# EAGLE design MCP4725_v14 (EAGLE 6.5.0)
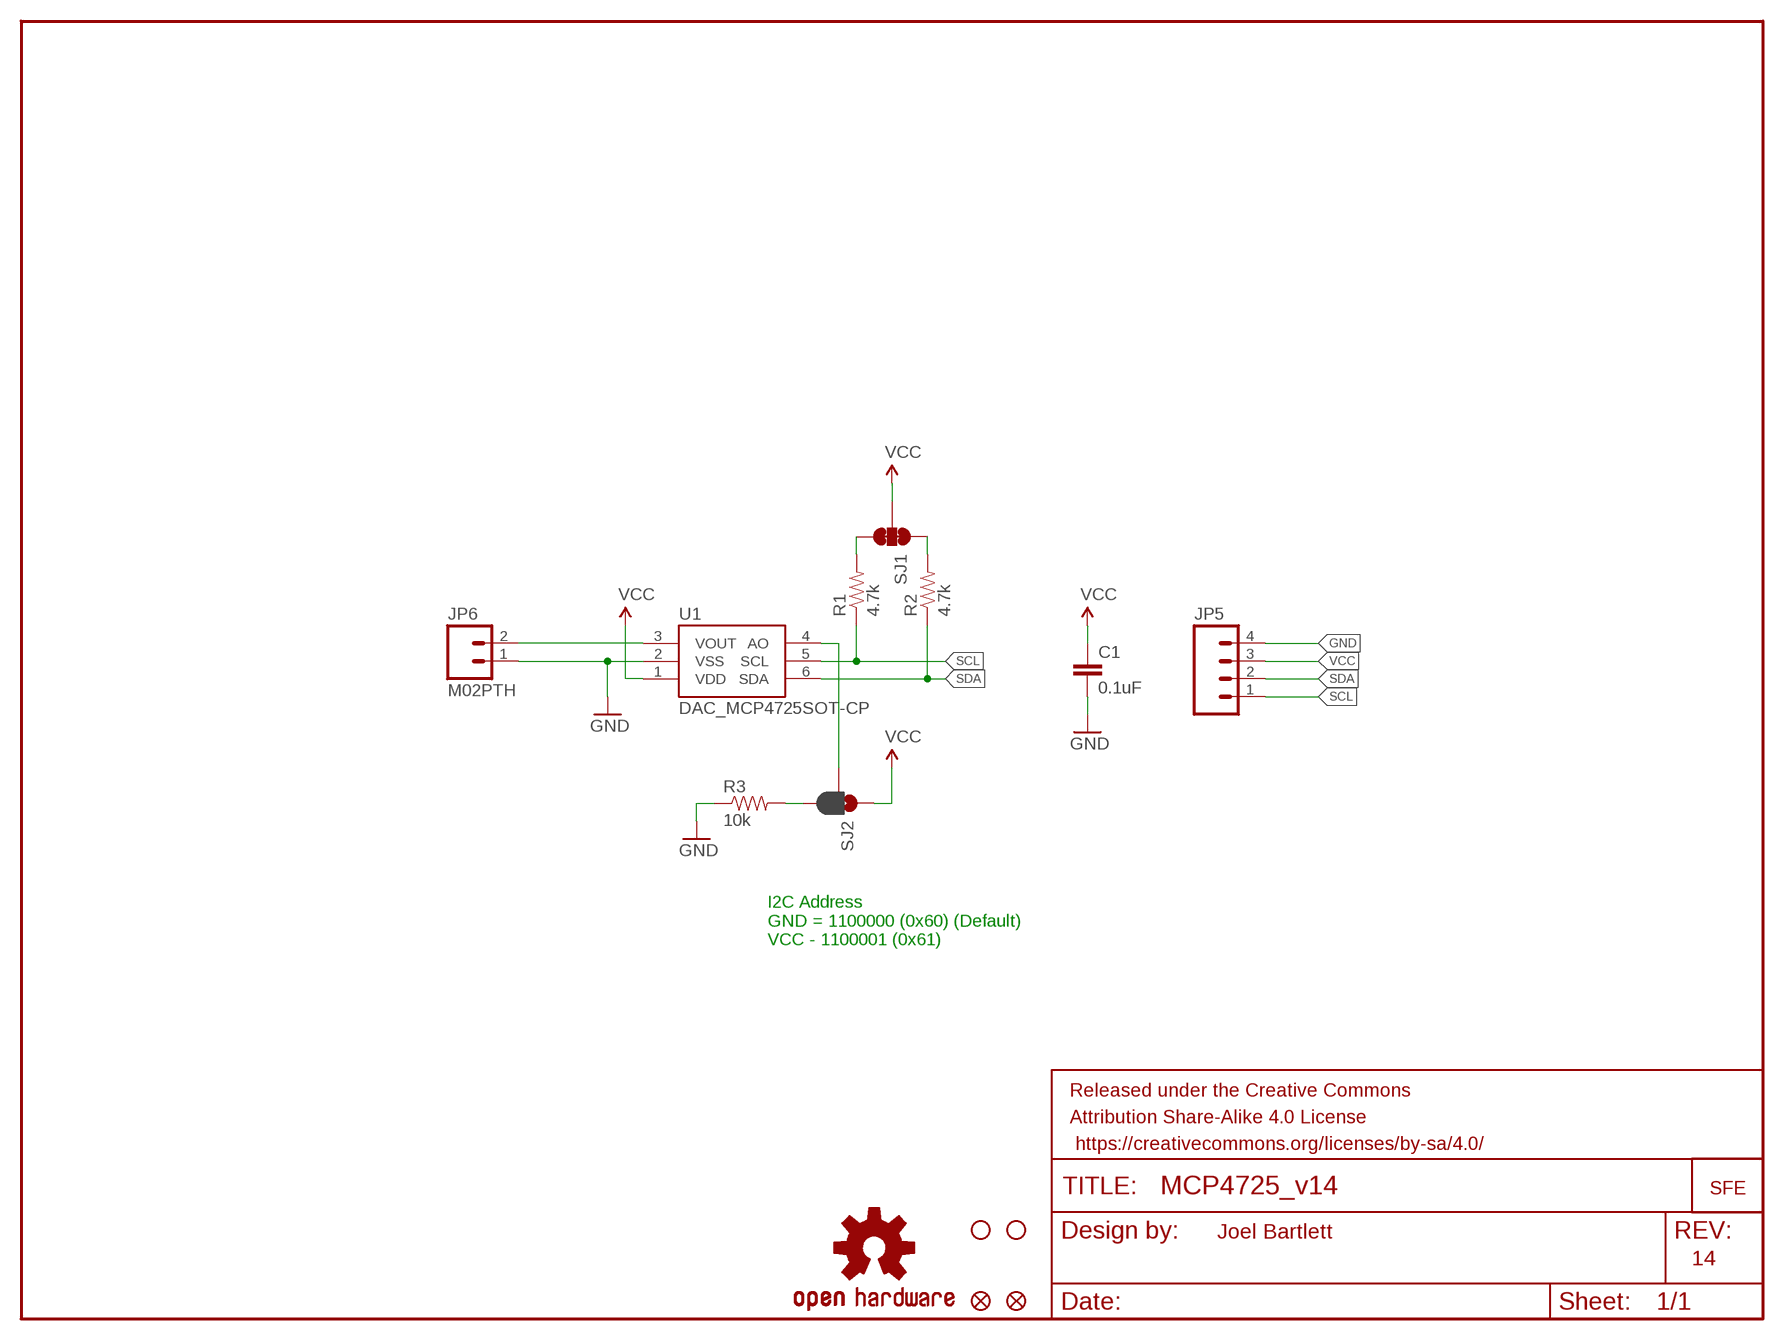
[diagram p0: schematic, sheet 1]

## Parts
C1  0.1uF  CAP0603-CAP  [0603-CAP]
FRAME2  FRAME-LETTER  [CREATIVE_COMMONS]
GND  LOGO-SFESK  [SFE-LOGO-FLAME]
JP2  FIDUCIALUFIDUCIAL  [MICRO-FIDUCIAL]
JP3  FIDUCIALUFIDUCIAL  [MICRO-FIDUCIAL]
JP5  M04PTH  [1X04]
JP6  M02PTH  [1X02]
LOGO1  OSHW-LOGOS  [OSHW-LOGO-S]
R1  4.7k  RESISTOR0603-RES  [0603-RES]
R2  4.7k  RESISTOR0603-RES  [0603-RES]
R3  10k  RESISTOR0603-RES  [0603-RES]
SJ1  JUMPER-PAD-3-NC_BY_TRACE  [PAD-JUMPER-3-3OF3_NC_BY_TRACE_YES_SILK_FULL_BOX]
SJ2  JUMPER-PAD-3-2OF3_NC_BY_PASTE  [PAD-JUMPER-3-2OF3_NC_BY_PASTE_YES_SILK_FULL_BOX]
STANDOFF1  STAND-OFF  [STAND-OFF]
STANDOFF2  STAND-OFF  [STAND-OFF]
U1  DAC_MCP4725SOT-CP  [SOT23-6-MCP4725]

## Nets
GND: C1.2 JP5.4 JP6.1 R3.1 U1.2(VSS)
N$1: R2.2 SJ1.1
N$2: R1.2 SJ1.3
N$3: SJ2.2 U1.4(AO)
N$4: R3.2 SJ2.3
SCL: JP5.1 R1.1 U1.5(SCL)
SDA: JP5.2 R2.1 U1.6(SDA)
VCC: C1.1 JP5.3 SJ1.2 SJ2.1 U1.1(VDD)
VOUT: JP6.2 U1.3(VOUT)

## Notes on the sheet
- I2C Address
  GND = 1100000 (0x60) (Default)
  VCC - 1100001 (0x61)
- Joel Bartlett
- 14

## Library data of the parts
C1 = SparkFun:CAP: Capacitor Standard 0603 ceramic capacitor, and 0.1" leaded capacitor.
FRAME2 = SparkFun-Aesthetics:FRAME-LETTER: Schematic Frame Standard 8.5x11 US Letter frame
GND = SparkFun:LOGO-SFE: Spark Fun Electronics PCB Logo This is the standard Spark Fun Electronics PCB logo.
JP2 JP3 = SparkFun:FIDUCIAL: Fiducial Alignment Points Various fiducial points for machine vision alignment.
JP5 = SparkFun-Connectors:M04: Header 4 Standard 4-pin 0.1" header. Use with straight break away headers (SKU : PRT-00116), right angle break away headers (PRT-00553), swiss pins (PRT-00743), machine pins (PRT-00117), and female headers (PRT-00115). Molex polarized connector foot print use with SKU : PRT-08231 with associated crimp pins and housings. 1MM SMD Version SKU: PRT-10208
JP6 = SparkFun-Connectors:M02: Standard 2-pin 0.1" header. Use with - straight break away headers ( PRT-00116) - right angle break away headers (PRT-00553) - swiss pins (PRT-00743) - machine pins (PRT-00117) - female headers (PRT-00115) Molex polarized connector foot print use with: PRT-08233 with associated crimp pins and housings. 2.54_SCREWTERM for use with PRT-10571. 3.5mm Screw Terminal footprints for PRT-08084 5mm Screw Terminal footprints for use with PRT-08433
LOGO1 = SparkFun-Aesthetics:OSHW-LOGO: Open Source Hardware Logo This logo indicates the piece of hardware it is found on incorporates a OSHW license and/or adheres to the definition of open source hardware found here: http://freedomdefined.org/OSHW
R1-R3 = SparkFun:RESISTOR: Resistor Basic schematic elements and footprints for 0603, 1206, and PTH resistors.
SJ1 = SparkFun-Passives:JUMPER-PAD-3-NC_BY_TRACE
SJ2 = SparkFun-Passives:JUMPER-PAD-3-2OF3_NC_BY_PASTE
STANDOFF1 STANDOFF2 = SparkFun-Electromechanical:STAND-OFF: #4 Stand Off This is the mechanical footprint for a #4 phillips button head screw. Use the keepout ring to avoid running the screw head into surrounding components. SKU : PRT-00447
U1 = SparkFun-AnalogIC:DAC_MCP4725: Microchip 12-bit I2C DAC, SOT23-6

## Board
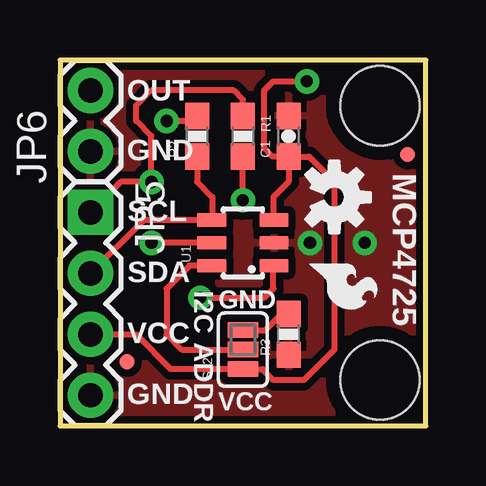
[diagram p1: board, top side]
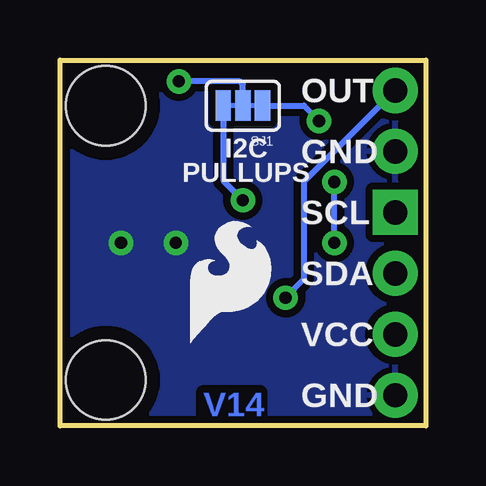
[diagram p2: board, bottom side, seen from below]

Size 15.24 x 15.24 mm. Coordinates in mm from the lower left corner, seen from the top.
Outline: 0,0 15.24,0 15.24,15.24 0,15.24 0,0
Copper layers (1*16): Top 0.035mm / dielectric 1.5mm / Bottom 0.035mm
Design rules "SparkFun-2-layer": minimum track width 7mil, minimum drill 15mil, track to track 8mil, track to pad 8mil, pad to pad 8mil, via to via 8mil, smd to smd 8mil, copper to edge 8mil, drill to drill 8mil, minimum pad ring 12mil, minimum via ring 10mil, stop-mask expansion 4mil, vias tented up to drill 20mil, thermal gap 10mil

### Footprints (pad centres in the part's own frame; a part is rotated, then mirrored left to right if it is on the bottom)
0603-CAP = smd 1.1 x 1: 1 -0.85,0; 2 0.85,0
MICRO-FIDUCIAL = smd 0.635 x 0.635: 1 0,0
1X04 = drill 1.016 pad 1.88 square: 1 0,0 | drill 1.016 pad 1.88: 2 2.54,0; 3 5.08,0; 4 7.62,0
1X02 = drill 1.016 pad 1.88: 1 0,0; 2 2.54,0
0603-RES = smd 1.1 x 1: 1 -0.85,0; 2 0.85,0
PAD-JUMPER-3-3OF3_NC_BY_TRACE_YES_SILK_FULL_BOX = smd 0.635 x 1.27: 1 -0.813,0; 2 0,0; 3 0.813,0
PAD-JUMPER-3-2OF3_NC_BY_PASTE_YES_SILK_FULL_BOX = smd 0.635 x 1.27: 1 -0.813,0; 2 0,0; 3 0.813,0
STAND-OFF = hole 3.302: 0,0
SOT23-6-MCP4725 = smd 0.55 x 1.2: 1 0.95,-1.3; 2 0,-1.3; 3 -0.95,-1.3; 4 -0.95,1.3; 5 0,1.3; 6 0.95,1.3

### Placement (x,y rotation side)
C1  9.53,12.06 90 top
FRAME2  21.59,-21.59 0 top  (outside the outline)
GND  10.41,6.73 270 top
JP2  2.79,2.67 0 top
JP3  14.48,11.3 0 top
JP5  1.27,8.89 270 top
JP6  1.27,11.43 90 top
LOGO1  11.43,9.53 270 top
R1  7.62,12.06 270 top
R2  5.71,12.06 90 top
R3  9.53,3.81 90 top
SJ1  7.62,13.34 180 bottom
SJ2  7.62,3.17 90 top
STANDOFF1  13.34,13.34 0 top
STANDOFF2  13.34,1.91 0 top
U1  7.62,7.62 90 top
U$3  [SFE_LOGO_FLAME_.2]  10.16,3.17 0 bottom

### Tracks (layer width: path | path; a pad name or v marks a point on that pad's centre or on a via)
GND  (via drill 0.51)
  other vias: 12.7,7.62 10.41,7.62
  pour Bottom (isolate 0.305): 0,15.24 0,0 15.24,0 15.24,15.24
  pour Top (isolate 0.305): 0,15.24 0,0 15.24,0 15.24,15.24
N$1  (via drill 0.51)
  Top 0.254: v4.45,12.7 5.5,12.7 R2.2
  Bottom 0.254: v4.45,12.7 5.08,13.34 SJ1.1
N$2  (via drill 0.51)
  Top 0.254: v7.62,9.4 R1.2
  Bottom 0.254: v7.62,9.4 8.43,10.21 SJ1.3
N$3
  Top 0.254: U1.4 5.4,6.67 4.45,5.71 4.45,3.81 5.08,3.17 SJ2.2
N$4
  Top 0.254: SJ2.3 8.56,3.99 9.23,4.66 R3.2
SCL  (via drill 0.51)
  Top 0.254: U1.5 v3.81,7.62 | JP5.1 2.54,10.16 v3.81,10.16 3.81,12.06 3.17,12.7 3.17,13.34 3.81,13.97 7.24,13.97 7.62,13.59 R1.1
  Bottom 0.254: v3.81,7.62 v3.81,10.16
SDA
  Top 0.254: JP5.2 3.49,8.57 U1.6 6.35,8.6 6.35,9.53 5.71,10.16 R2.1
VCC  (via drill 0.51)
  Top 0.254: JP5.3 3.17,3.81 4.62,2.36 SJ2.1 8.43,2.36 8.89,1.91 10.16,1.91 11.43,3.17 11.43,10.16 10.38,11.21 C1.1 | C1.1 8.85,11.21 8.51,11.56 8.51,13.97 8.89,14.35 v10.29,14.35 | C1.1 9.53,10.16 8.89,9.53 8.89,8.6 U1.1
  Bottom 0.254: SJ1.2 7.62,14.22 7.75,14.35 v10.29,14.35
VOUT  (via drill 0.51)
  Top 0.254: v5.84,5.33 8.51,5.33 8.89,5.71 8.89,6.64 U1.3
  Bottom 0.254: v5.84,5.33 5.08,6.1 5.08,10.16 JP6.2

### Text on the board
Bottom: V14
tPlace: OUT | GND | MCP4725 | SCL | SDA | I2C | GND | VCC | ADDR | GND | VCC
bPlace: OUT | GND | I2C | PULLUPS | SCL | SDA | VCC | GND